# Altium schematic sheet MAX9020.SchDoc
size A4; Organization: TESLA Motors, INC; Address1: 3500 Deer Creek Road; Address2: Palo Alto, CA; Address4: U.S.A.; SheetNumber: 3; SheetTotal: 5
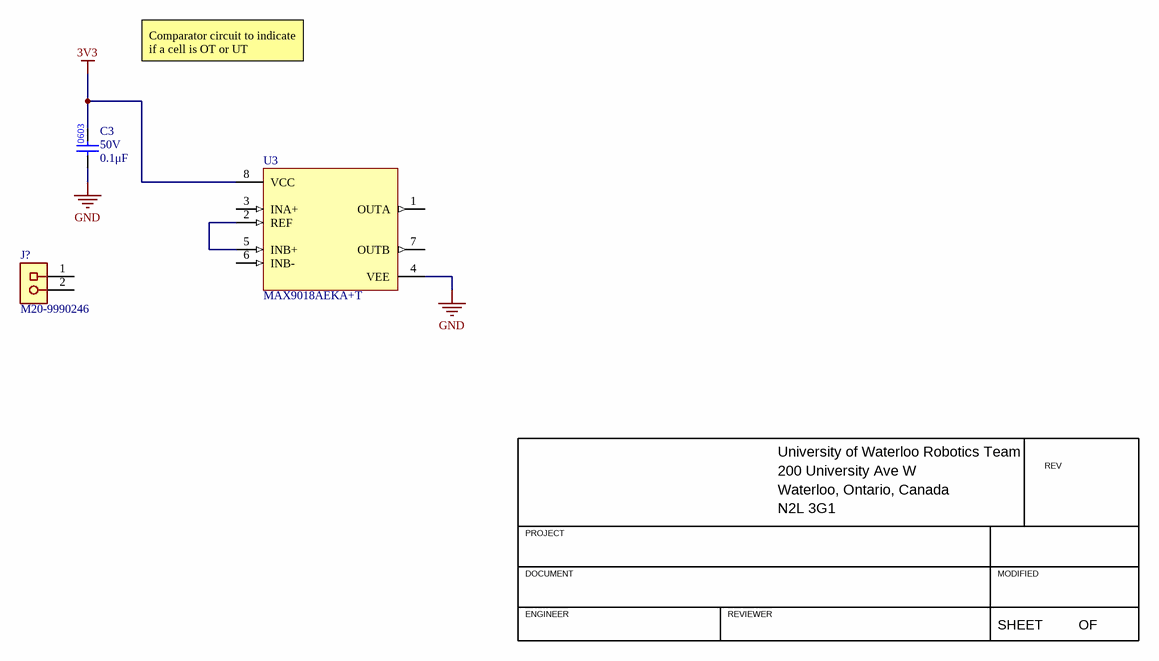
[diagram p0: MAX9020.SchDoc]

## Parts
C3  value 0.1μF  Voltage Rating: 50V  [CAP0603]  (hidden comment: CAP_0.1uF_50V_0603)
J?  Manufacturer Part Number 1: M20-9990246  [HDR1X2]  (hidden comment: HEADER 2x1)
U3  Manufacturer Part Number 1: MAX9018AEKA+T  [SOT23-8 MAXIM]  (hidden comment: IC_COMPARATOR_MAX9018)

## Nets
3V3: C3.2 U3.8(VCC)
GND: C3.1 U3.4(VEE)
NetU3_2: U3.2(REF) U3.5(INB+)

Not connected (* = marked no-connect by the designer): J? 1(VCC) 2; U3 1(OUTA) 3(INA+) 6(INB-) 7(OUTB)

## Notes on the sheet
- Comparator circuit to indicate if a cell is OT or UT
- University of Waterloo Robotics Team
- 200 University Ave W
- REV
- PROJECT
- Waterloo, Ontario, Canada
- N2L 3G1
- DOCUMENT
- ENGINEER
- REVIEWER
- MODIFIED
- SHEET
- OF

## Library data of the parts
C3 = CAP_0.1uF_50V_0603: CAP CER 0.1UF 50V X7R 0603; Manufacturer Part Number 1: CC0603KRX7R9BB104; Manufacturer 1: Yageo; Package/Footprint: 0603; Supplier Part Number 1: 311-1344-1-ND; Supplier 1: Digi-Key; Mounting Type: SMD; Dielectric: X7R
J? = HEADER 2x1: Manufacturer 1: Harwin Inc.; Package/Footprint: TH; Mounting Type: TH; Supplier 1: Digi-Key; Supplier Part Number 1: 952-2262-ND
U3 = IC_COMPARATOR_MAX9018: IC COMPARATOR DUAL SOT23-8; Manufacturer 1: Analog Devices Inc./Maxim Integrated; Package/Footprint: SOT-23-8; Mounting Type: SMD; Supplier 1: Digi-Key; Supplier Part Number 1: MAX9018AEKA+TCT-ND